# Altium project loz-old-man.PrjPcb (part 5 of 5)

## Sheet USB.SchDoc
size B; Organization: Pyrotechnics Management Inc.; DocumentNumber: 13; SheetNumber: 13; SheetTotal: 14; PageSetup: Record=PageOptions|CenterHorizontal=True|CenterVertical=True|PrintScale=0.99|XCorrection=1.00|YCorrection=1.00|PrintKind=1|BorderSize=5000000|LeftOffset=0|BottomOffset=0|Orientation=2|PaperLength=1000|PaperWidth=1000|Scale=100|PaperSource=7|PrintQuality=-4|MediaType=1|DitherType=10|PaperKind=Tabloid (11 x 17")|PrintScaleMode=1; SCHEMATIC_SHEET_TITLE: USB HOST; PAGE_TITLE: -
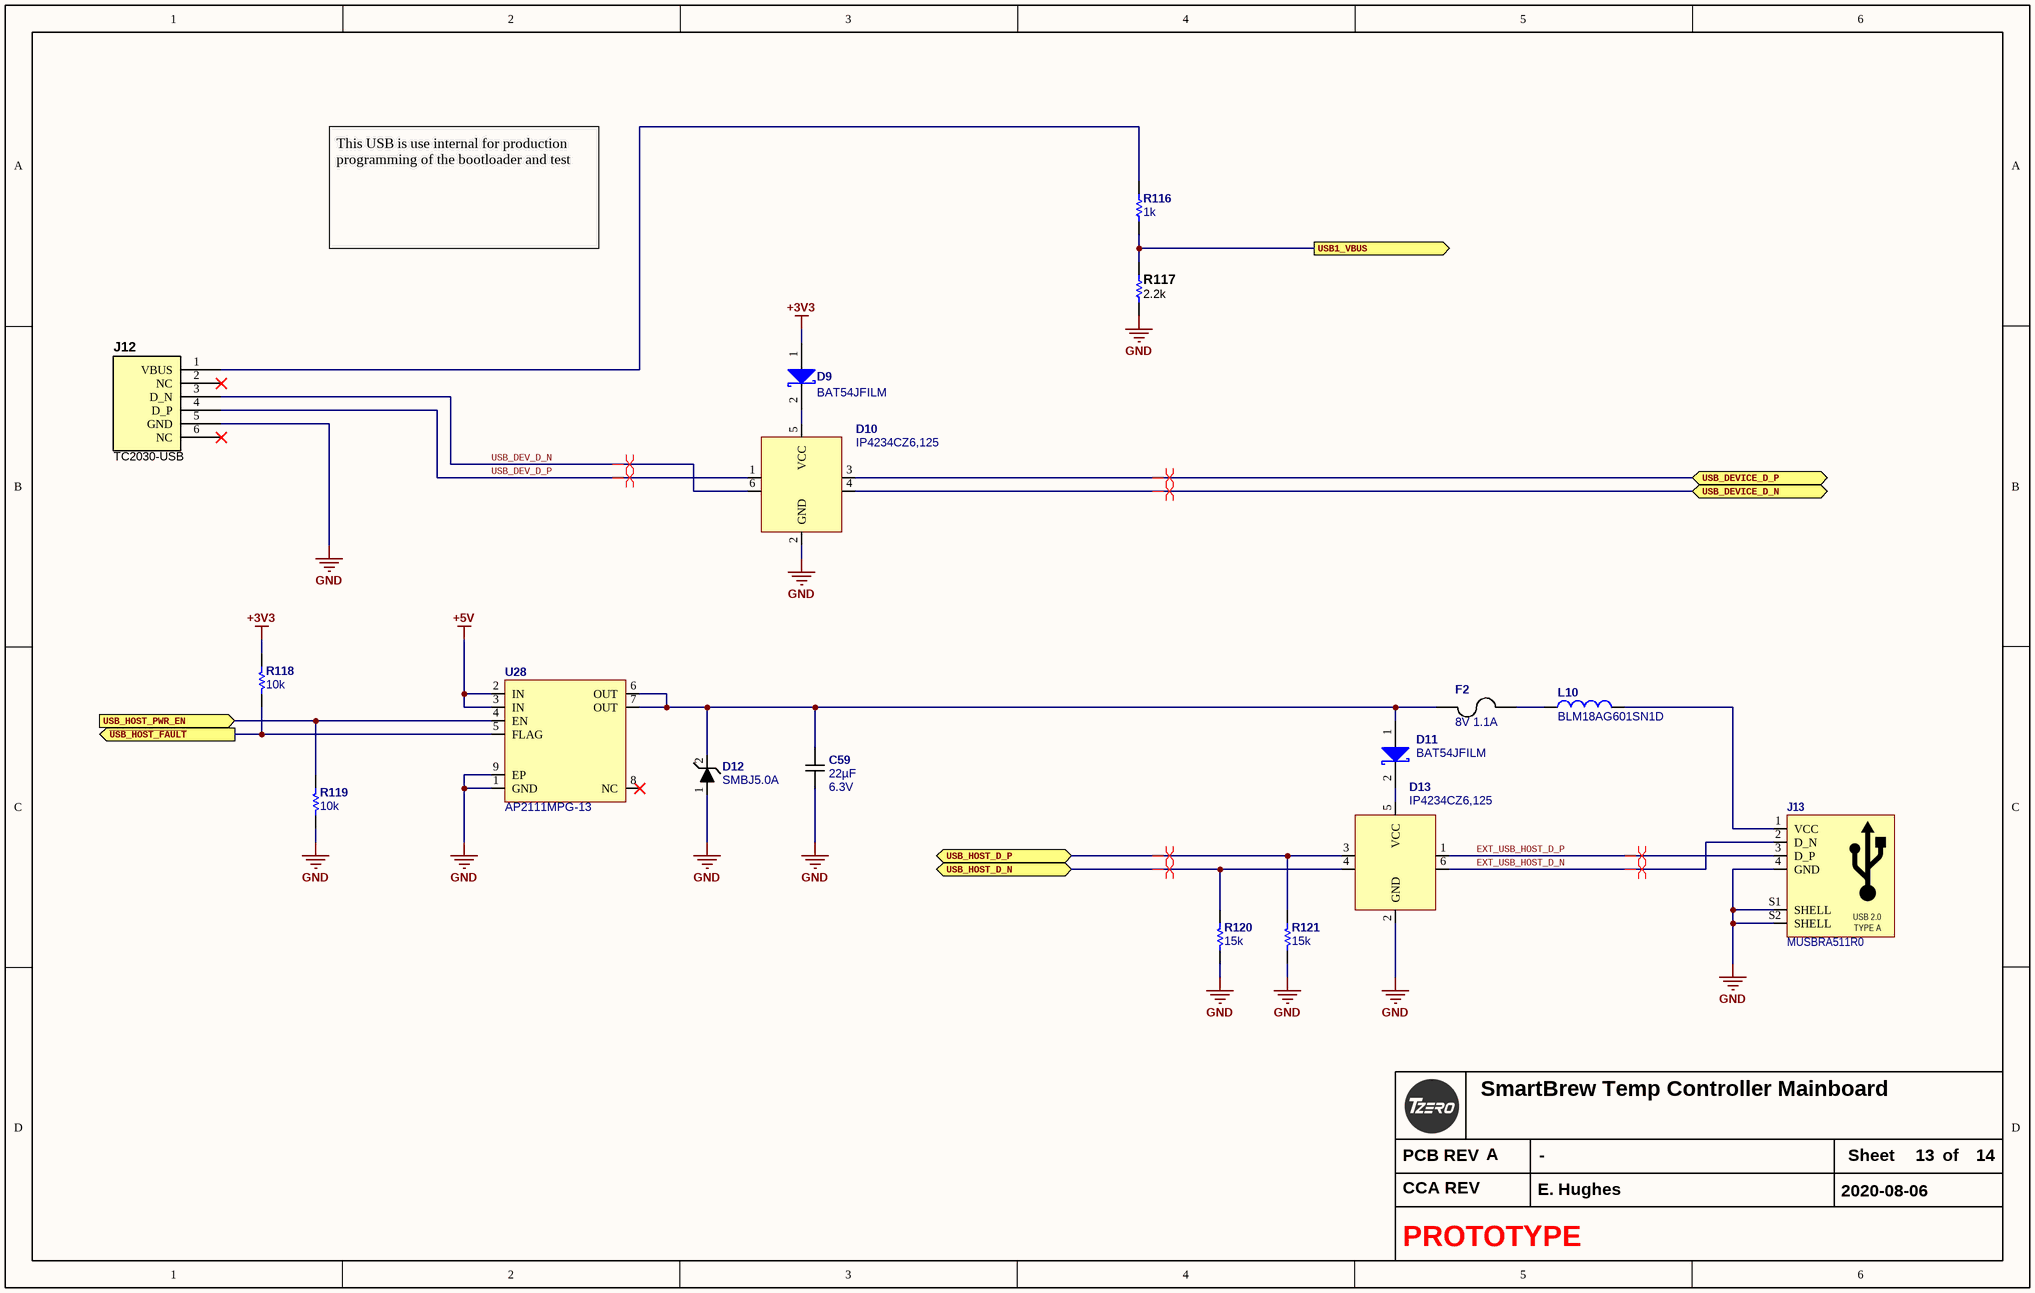
[diagram p12: USB.SchDoc]

### Parts
C59  22µF  Voltage - Rated: 6.3V  [C1206_1.60MM_HD]
D9  BAT54JFILM  [SOD-323]
D10  IP4234CZ6,125  [SOT427_MEDIUM]
D11  BAT54JFILM  [SOD-323]
D12  SMBJ5.0A  [D_SMB_P]
D13  IP4234CZ6,125  [SOT427_MEDIUM]
F2  8V 1.1A  [F_PTC_1206]
J12  TC2030‐USB  [TC2030]  (no BOM)
J13  MUSBRA511R0  [AMPHENOL_MUSBR-A511]
L10  BLM18AG601SN1D  [L_0603_0.8mm]
R116  1k  [R0603_0.55MM_MD]
R117  2.2k  [R0603_0.55MM_MD]
R118  10k  [R0603_0.55MM_MD]
R119  10k  [R0603_0.55MM_MD]
R120  15k  [R0603_0.55MM_MD]
R121  15k  [R0603_0.55MM_MD]
U28  AP2111MPG-13  [MSOP-8E]

### Ports
USB1_VBUS (out), USB_DEVICE_D_N (bidir), USB_DEVICE_D_P (bidir), USB_HOST_D_N (bidir), USB_HOST_D_P (bidir), USB_HOST_PWR_EN (in), ~{USB_HOST_FAULT} (out)

### Nets
+3V3: D9.1(A) R118.2
+5V: U28.2(IN) U28.3(IN)
GND: C59.1 D10.2(GND) D12.1(A) D13.2(GND) J12.5(GND) J13.4(GND) J13.S1(SHELL) J13.S2(SHELL) R117.1 R119.1 R120.1 R121.1 U28.1(GND) U28.9(EP)
~{USB_HOST_FAULT}: R118.1 U28.5(FLAG) ; port ~{USB_HOST_FAULT}
EXT_USB_HOST_D_N: D13.6 J13.2(D_N)
EXT_USB_HOST_D_P: D13.1 J13.3(D_P)
USB1_VBUS: R116.2 R117.2 ; port USB1_VBUS
USB_DEV_D_N: D10.6 J12.3(D_N)
USB_DEV_D_P: D10.1 J12.4(D_P)
USB_DEVICE_D_N: D10.4 ; port USB_DEVICE_D_N
USB_DEVICE_D_P: D10.3 ; port USB_DEVICE_D_P
USB_HOST_D_N: D13.4 R120.2 ; port USB_HOST_D_N
USB_HOST_D_P: D13.3 R121.2 ; port USB_HOST_D_P
USB_HOST_PWR_EN: R119.2 U28.4(EN) ; port USB_HOST_PWR_EN
NetC59_2: C59.2 D11.1(A) D12.2(K) F2.2 U28.6(OUT) U28.7(OUT)
NetD9_2: D9.2(K) D10.5(VCC)
NetD11_2: D11.2(K) D13.5(VCC)
NetF2_1: F2.1 L10.2
NetJ12_1: J12.1(VBUS) R116.1
NetJ13_1: J13.1(VCC) L10.1

Not connected (* = marked no-connect by the designer): J12 2(NC)* 6(NC)*; U28 8(NC)*

### Layout directives
differential pair; differential pair class DIFF90: EXT_USB_HOST_D_N, EXT_USB_HOST_D_P, USB_DEV_D_N, USB_DEV_D_P, USB_DEVICE_D_N, USB_DEVICE_D_P, USB_HOST_D_N, USB_HOST_D_P

### Notes on the sheet
- This USB is use internal for production programming of the bootloader and test
- PCB REV
- Sheet
- of
- CCA REV
- (in symbol MUSBRA511R0) USB 2.0 / TYPE A

### Library data of the parts
C59 = CGA5L1X7R0J226M160AC: CAP CER 22UF 6.3V X7R 1206; Manufacturer: TDK Corporation; Tolerance: ±20%; Substitution Notes: 22µF , 6.3V , ±20% , X7R , -55°C ~ 125°C , AEC-Q200 , 1206; Value: 22µF; Temperature Coefficient: X7R; Manufacturer Part Number: CGA5L1X7R0J226M160AC; ComponentLink1Description: Datasheet (Internal); ComponentLink1URL: datasheets\TDK\mlcc_automotive_general_en.pdf; ComponentLink2Description: Datasheet (External); ComponentLink2URL: https://product.tdk.com/info/en/catalog/datasheets/mlcc_automotive_general_en.pdf; Supplier 1: Digikey; Supplier Part Number 1: 445-7884-1-ND; Category: Capacitors; Features: -; Ratings: AEC-Q200; Package: 1206; Thickness (Max): 1.60MM; Operating Temperature: -55°C ~ 125°C
D9 D11 = BAT54JFILM: DIODE SCHOTTKY 40V 300MA SOD323; Manufacturer: STMicroelectronics; CategorySort: 400; Reverse Recovery Time: 5ns; Peak Non-Repetitive Surge Current: 1A; Element Configuration: Single; Forward Voltage: 900mV; Packaging 1: Tape and Reel; Max Reverse Leakage Current: 1uA; Peak Reverse Current: 100uA; Polarity: Standard; Voltage Rating (DC): 30V; Capacitance: 10pF; Category: Diodes; Value: BAT54JFILM; Supplier 1: Digi-Key; Supplier Part Number 1: 497-7163-1-ND; Manufacturer Part Number: BAT54JFILM; Stock 1: 46673; Pricing 1: 1=0.36000, 10=0.29200, 100=0.11960, 500=0.09978, 1000=0.06933 (USD); RoHS: Yes; Mount: Surface Mount; Case/Package: SC; Number of Pins: 2; Weight: 0.01lb; Contact Plating: Tin,Matte; Min Operating Temperature: -40°C; Max Operating Temperature: 150°C; Forward Current: 300mA; Max Repetitive Reverse Voltage (Vrrm): 40V; Max Surge Current: 1A; Package Quantity: 1; Recovery Time: 5ns; Average Rectified Current: 300mA; Max Forward Surge Current (Ifsm): 1A; Termination: SMD/SMT; Output Current: 300mA; Current Rating: 300mA; Max Reverse Voltage (DC): 40V; Length: 1.8mm; Height: 1.07mm; Width: 1.45mm; Radiation Hardening: No; REACH SVHC: No SVHC; Lead Free: Lead Free; ComponentLink1URL: https://datasheet.ciiva.com/1177/1689724-1177952.pdf?src-supplier=Element14; ComponentLink1Description: https://datasheet.ciiva.com/1177/1689724-1177952.pdf?src-supplier=Element14; ComponentLink2URL: https://datasheet.ciiva.com/1200/1689724-1200625.pdf?src-supplier=Farnell; ComponentLink2Description: https://datasheet.ciiva.com/1200/1689724-1200625.pdf?src-supplier=Farnell; ComponentLink3URL: https://datasheet.ciiva.com/1200/cd00001322-1200626.pdf?src-supplier=Farnell; ComponentLink3Description: https://datasheet.ciiva.com/1200/cd00001322-1200626.pdf?src-supplier=Farnell; ComponentLink4URL: https://datasheet.ciiva.com/15192/getdatasheetpartid-185078-15192983.pdf?src-supplier=Verical; ComponentLink4Description: https://datasheet.ciiva.com/15192/getdatasheetpartid-185078-15192983.pdf?src-supplier=Verical; ComponentLink5URL: https://datasheet.ciiva.com/915/cd00001322-915529.pdf?src-supplier=Digi-Key; ComponentLink5Description: https://datasheet.ciiva.com/915/cd00001322-915529.pdf?src-supplier=Digi-Key; ComponentLink6URL: https://datasheet.ciiva.com/25954/cd00001322-25954459.pdf?src-supplier=Avnet+Europe; ComponentLink6Description: https://datasheet.ciiva.com/25954/cd00001322-25954459.pdf?src-supplier=Avnet+Europe; ComponentLink7URL: https://datasheet.ciiva.com/1177/1689724-1177950.pdf?src-supplier=Element14; ComponentLink7Description: https://datasheet.ciiva.com/1177/1689724-1177950.pdf?src-supplier=Element14; ComponentLink8URL: https://datasheet.ciiva.com/915/cd00001322-915527.pdf?src-supplier=Digi-Key; ComponentLink8Description: https://datasheet.ciiva.com/915/cd00001322-915527.pdf?src-supplier=Digi-Key; ComponentLink9URL: https://datasheet.ciiva.com/915/cd00001322-915528.pdf?src-supplier=Digi-Key; ComponentLink9Description: https://datasheet.ciiva.com/915/cd00001322-915528.pdf?src-supplier=Digi-Key; ComponentLink10URL: https://datasheet.ciiva.com/1177/1689724-1177951.pdf?src-supplier=Element14; ComponentLink10Description: https://datasheet.ciiva.com/1177/1689724-1177951.pdf?src-supplier=Element14; ComponentLink11URL: https://datasheet.ciiva.com/7622/1689724-7622351.pdf?src-supplier=Element14; ComponentLink11Description: https://datasheet.ciiva.com/7622/1689724-7622351.pdf?src-supplier=Element14
D10 D13 = IP4234CZ6,125: IC USB2.0 ESD PROTECTION SOT457; Manufacturer: NXP Semiconductors; CategorySort: 400; Voltage - Reverse Standoff (Typ): 3V; Voltage - Breakdown: 6V; Power (Watts): 100W; Polarization: 2 Channel Array - Bidirectional; Value: IP4234CZ6,125; Sort Value: *; Category: Diodes; Supplier 1: Digi-Key; Supplier Part Number 1: 568-5869-1-ND; Manufacturer Part Number: IP4234CZ6,125; RoHS: RoHS Compliant; Stock 1: 5142; Pricing 1: 1=0.52, 10=0.418, 25=0.3656, 100=0.3135, 250=0.27076, 500=0.23276, 1000=0.1805 (USD); Mounting Type: Surface Mount; Package: SC-74, SOT-457; Supplier Device Package: 6-TSOP; Packaging: Cut Tape (CT); ComponentLink1URL: http://www.nxp.com/documents/data_sheet/IP4234CZ6.pdf; ComponentLink1Description: http://www.nxp.com/documents/data_sheet/IP4234CZ6.pdf; Manufacturer 1: NXP Semiconductors; Manufacturer Part Number 1: IP4234CZ6,125
D12 = SMBJ5.0A: TVS 5.0 VOLT 600 WATT UNI-DIR SM; Manufacturer: Littelfuse Inc; CategorySort: 850; Voltage - Reverse Standoff (Typ): 5V; Voltage - Breakdown: 6.4V; Power (Watts): 600W; Polarization: Unidirectional; Diode Suffix: 1A_2C; Value: SMBJ5.0A; Category: Circuit Protection; Supplier 1: Digi-Key; Supplier Part Number 1: SMBJ5.0ALFCT-ND; Manufacturer Part Number: SMBJ5.0A; Package: DO-214AA- SMB; Packaging: Cut Tape (CT); ComponentLink1URL: http://www.littelfuse.com/~/media/Files/Littelfuse/Technical%20Resources/Documents/Data%20Sheets/Littelfuse_TVS%20Diode_SMBJ.pdf; ComponentLink1Description: Internal Datasheet; ComponentLink2Description: External Datasheet; ComponentLink2URL: http://www.littelfuse.com/~/media/Files/Littelfuse/Technical%20Resources/Documents/Data%20Sheets/Littelfuse_TVS%20Diode_SMBJ.pdf; Stocked: -; SortValue: SMBJ5.0A; Pricing: 1 = 0.46  ;  10 = 0.384  ;  25 = 0.336  ;  100 = 0.2877  ;  250 = 0.24952  ;  500 = 0.21134  ;  1000 = 0.16293 (USD); Sales Status: Active; Mounting Type: Surface Mount; Supplier Device Package: SMB
F2 = 1206L110THYR: FUSE PTC RESET 8V 1.10A 1206; Manufacturer: Littelfuse Inc; CategorySort: 850; Current - Trip (It): 2.2A; Current - Max: 100A; R Min/Max: 0.040 ~ 0.180 Ohm; Time to Trip: 0.1s; Current Trip: 1.1; Value: 8V 1.1A; Sort Value: *; Category: Circuit Protection; Manufacturer Part Number: 1206L110THYR; ComponentLink1Description: Internal Datasheet; ComponentLink1URL: http://www.littelfuse.com/data/en/Data_Sheets/Littelfuse_PTC_1206L.pdf; ComponentLink2Description: External Datasheet; ComponentLink2URL: http://www.littelfuse.com/data/en/Data_Sheets/Littelfuse_PTC_1206L.pdf; Supplier 1: Digi-Key; Supplier Part Number 1: F3371CT-ND; SortValue: 8_1.1; Current - Hold (Ih) (Max): 1.1A; Voltage - Max: 8V; Package: 1206 (3216 Metric)- Concave- Long Side Terminals; Packaging: Cut Tape (CT); Footprint: 1206
J12 = TC2030‐USB: Tag Connect Pads - No latching Clips - USB; Value: TC2030‐USB
J13 = MUSBRA511R0: CONN RCPT USB2.0 TYPEA 4POS PCB; Manufacturer: Amphenol Industrial; CategorySort: 800; Packaging 1: Bulk; Connector Type: USB; Number of Contacts: 4; Gender: Receptacle; Ratings: IP67; Category: Connectors; Value: MUSBRA511R0; Supplier 1: Digi-Key; Supplier Part Number 1: MUSBRA511R0-ND; Manufacturer Part Number: MUSBRA511R0; Stock 1: 619; Pricing 1: 1=9.44000, 10=9.02900, 25=8.20800, 50=7.79760, 100=7.59240, 250=6.77160, 500=6.36120, 1000=5.92800 (USD); RoHS: Yes; Mount: Through Hole,Panel; Orientation: Straight; Features: Shielded; Flammability Rating: UL94 V-0; ComponentLink1URL: https://cdn.amphenol-icc.com/media/wysiwyg/files/documentation/datasheet/inputoutput/io_harsh_musb-type-a-b-ab.pdf?src-supplier=Digi-Key; ComponentLink1Description: https://cdn.amphenol-icc.com/media/wysiwyg/files/documentation/datasheet/inputoutput/io_harsh_musb-type-a-b-ab.pdf?src-supplier=Digi-Key
L10 = BLM18AG601SN1D: FERRITE CHIP 600 OHM 500MA 0603; Manufacturer: Murata Electronics North America; CategorySort: 300; Impedance @ Frequency: 600 Ohm @ 100MHz; DC Resistance (DCR): 380 mOhm Max; Filter Type: Differential Mode - Single; Value: BLM18AG601SN1D; Sort Value: *; Category: Inductors; Supplier 1: Digi-Key; Supplier Part Number 1: 490-1014-1-ND; Manufacturer Part Number: BLM18AG601SN1D; RoHS: RoHS Compliant; Stock 1: 139441; Pricing 1: 1=0.1, 10=0.079, 50=0.0648, 100=0.0476, 250=0.0346, 500=0.0317, 1000=0.02738 (USD); Packaging: Cut Tape (CT); Current Rating: 500mA; Package: 0603 (1608 Metric); Mounting Type: Surface Mount; Height (Max): 0.037" (0.95mm); Size / Dimension: 0.063" L x 0.031" W (1.60mm x 0.80mm); ComponentLink1URL: http://search.murata.co.jp/Ceramy/image/img/PDF/ENG/L0110S0100BLM18A.pdf; ComponentLink1Description: http://search.murata.co.jp/Ceramy/image/img/PDF/ENG/L0110S0100BLM18A.pdf
R116 = ERJ-3EKF1001V: RES 1K OHM 1/10W 1% 0603 SMD; Manufacturer: Panasonic Electronic Components; Package Power: 0603  (0.1W); Power (Watts): 0.1W- 1/10W; Temperature Coefficient: ±100ppm/°C; Limiting Element Voltage: 75; Maximum Overload Voltage: 150; Maximum Working Voltage: 10.0V; Substitution Notes: 1k , ±1% , 0603 , AEC-Q200; Value: 1k; Manufacturer Part Number: ERJ-3EKF1001V; ComponentLink1Description: Internal Datasheet; ComponentLink1URL: datasheets\Panasonic Electronic Components\AOA0000CE2.pdf; ComponentLink2Description: External Datasheet; ComponentLink2URL: http://industrial.panasonic.com/www-data/pdf/AOA0000/AOA0000CE2.pdf; Supplier 1: Digi-Key; Supplier Part Number 1: P1.00KHCT-ND; Category: Resistors; Resistance (Ohms): 1k; Composition: Thick Film; Features: -; Tolerance: ±1%; Package: 0603 (1608 Metric); Supplier Package: 0603; Size / Dimension: 0.063" L x 0.031" W (1.60mm x 0.80mm); Height: 0.55MM; Number of Terminations: 2; Packaging: Cut Tape (CT); Sort Value: 1000; Sort Value Package: 603_1000; Ratings: AEC-Q200
R117 = ERJ-3EKF2201V: RES 2.2K OHM 1/10W 1% 0603 SMD; Manufacturer: Panasonic Electronic Components; Package Power: 0603  (0.1W); Power (Watts): 0.1W- 1/10W; Temperature Coefficient: ±100ppm/°C; Limiting Element Voltage: 75; Maximum Overload Voltage: 150; Maximum Working Voltage: 14.8V; Substitution Notes: 2.2k , ±1% , 0603 , AEC-Q200; Value: 2.2k; Manufacturer Part Number: ERJ-3EKF2201V; ComponentLink1Description: Internal Datasheet; ComponentLink1URL: datasheets\Panasonic Electronic Components\AOA0000CE2.pdf; ComponentLink2Description: External Datasheet; ComponentLink2URL: http://industrial.panasonic.com/www-data/pdf/AOA0000/AOA0000CE2.pdf; Supplier 1: Digi-Key; Supplier Part Number 1: P2.20KHCT-ND; Category: Resistors; Resistance (Ohms): 2.2k; Composition: Thick Film; Features: -; Tolerance: ±1%; Package: 0603 (1608 Metric); Supplier Package: 0603; Size / Dimension: 0.063" L x 0.031" W (1.60mm x 0.80mm); Height: 0.55MM; Number of Terminations: 2; Packaging: Cut Tape (CT); Sort Value: 2200; Sort Value Package: 603_2200; Ratings: AEC-Q200
R118 R119 = ERJ-3EKF1002V: RES 10K OHM 1/10W 1% 0603 SMD; Manufacturer: Panasonic Electronic Components; Power (Watts): 0.1W- 1/10W; Temperature Coefficient: ±100ppm/°C; Package Power: 0603  (0.1W); Limiting Element Voltage: 75; Maximum Overload Voltage: 150; Maximum Working Voltage: 31.6V; Substitution Notes: 10k , ±1% , 0603 , AEC-Q200; Value: 10k; Supplier 1: Digi-Key; Supplier Part Number 1: P10.0KHCT-ND; Manufacturer Part Number: ERJ-3EKF1002V; Category: Resistors; Sort Value: 10000; Composition: Thick Film; Features: -; Tolerance: ±1%; Package: 0603 (1608 Metric); Size / Dimension: 0.063" L x 0.031" W (1.60mm x 0.80mm); Height: 0.55MM; Packaging: Cut Tape (CT); ComponentLink1URL: datasheets\Panasonic Electronic Components\AOA0000CE2.pdf; ComponentLink1Description: Internal Datasheet; ComponentLink2Description: External Datasheet; ComponentLink2URL: http://industrial.panasonic.com/www-data/pdf/AOA0000/AOA0000CE2.pdf; Resistance (Ohms): 10k; Supplier Package: 0603; Number of Terminations: 2; Sort Value Package: 603_10000; Ratings: AEC-Q200
R120 R121 = ERJ-3EKF1502V: RES 15K OHM 1/10W 1% 0603 SMD; Manufacturer: Panasonic Electronic Components; Power (Watts): 0.1W- 1/10W; Temperature Coefficient: ±100ppm/°C; Package Power: 0603  (0.1W); Limiting Element Voltage: 75; Maximum Overload Voltage: 150; Maximum Working Voltage: 38.7V; Substitution Notes: 15k , ±1% , 0603 , AEC-Q200; Value: 15k; Supplier 1: Digi-Key; Supplier Part Number 1: P15.0KHCT-ND; Manufacturer Part Number: ERJ-3EKF1502V; Category: Resistors; Sort Value: 15000; Composition: Thick Film; Features: -; Tolerance: ±1%; Package: 0603 (1608 Metric); Size / Dimension: 0.063" L x 0.031" W (1.60mm x 0.80mm); Height: 0.55MM; Packaging: Cut Tape (CT); ComponentLink1URL: datasheets\Panasonic Electronic Components\AOA0000CE2.pdf; ComponentLink1Description: Internal Datasheet; ComponentLink2Description: External Datasheet; ComponentLink2URL: http://industrial.panasonic.com/www-data/pdf/AOA0000/AOA0000CE2.pdf; Resistance (Ohms): 15k; Supplier Package: 0603; Number of Terminations: 2; Sort Value Package: 603_15000; Ratings: AEC-Q200
U28 = AP2111MPG-13: IC USB SWITCH 2.45A CURR 8MSOP; Manufacturer: Diodes; CategorySort: 600; Packaging 1: Tape and Reel; Number of Outputs: 1; Max Output Current: 2A; Min Input Voltage: 2.5V; Max Input Voltage: 6V; Quiescent Current: 55uA; Accuracy: 1.5%; Output Type: Fixed; Interface: On/Off; Fault Protection: Over Temperature,Reverse Current; Output Configuration: High Side; Operating Supply Current: 45uA; Category: Integrated Circuits; Value: AP2111MPG-13; Supplier 1: Digi-Key; Supplier Part Number 1: AP2111MPG-13DICT-ND; Manufacturer Part Number: AP2111MPG-13; Stock 1: 1715; Pricing 1: 1=0.46000, 10=0.39000, 100=0.29120, 500=0.22880, 1000=0.17680 (USD); RoHS: Yes; Mount: Surface Mount; Case/Package: MSOP; Number of Pins: 8; Contact Plating: Tin,Matte; Min Operating Temperature: -35°C; Max Operating Temperature: 85°C; Package Quantity: 2500; Radiation Hardening: No; REACH SVHC: No SVHC; Lead Free: Lead Free; ComponentLink1URL: https://datasheet.ciiva.com/3234/ap2101-2111-3234512.pdf?src-supplier=Avnet; ComponentLink1Description: https://datasheet.ciiva.com/3234/ap2101-2111-3234512.pdf?src-supplier=Avnet; ComponentLink2URL: https://datasheet.ciiva.com/15108/getdatasheetpartid-661766-15108856.pdf?src-supplier=Verical; ComponentLink2Description: https://datasheet.ciiva.com/15108/getdatasheetpartid-661766-15108856.pdf?src-supplier=Verical; ComponentLink3URL: https://datasheet.ciiva.com/1962/ap2101-2111-1962212.pdf?src-supplier=Digi-Key; ComponentLink3Description: https://datasheet.ciiva.com/1962/ap2101-2111-1962212.pdf?src-supplier=Digi-Key; ComponentLink4URL: https://datasheet.ciiva.com/12183/ap2101-2111-12183962.pdf?src-supplier=Mouser; ComponentLink4Description: https://datasheet.ciiva.com/12183/ap2101-2111-12183962.pdf?src-supplier=Mouser

## Nets that join several sheets
+3V3: SolenoidDrive (8 pins), Cell (J6.2 R31.2 U15.20 U16.5), LCD_IO (J11.1 J11.2 J11.3 J11.6), SensorInterface (5 pins), Encoder (R22.2 R23.2 R24.2), POWER (C12.1 J3.2 U2.3), RAM (17 pins), CAN (U17.3), Microprocessor1 (5 pins), Microprocessor Power (42 pins), Flash Memory (22 pins), USB (D9.1 R118.2)
+5V: Cell (C33.2 J6.1 J7.1), LCD_IO (C57.2 L9.1 U27.4 U27.5), POWER (J4.2), USB (U28.2 U28.3)
+12V_FILT: TOP_LEVEL (J2.1), SolenoidDrive (C19.1 D3.2 U4.3), SensorInterface (U13.8), POWER (5 pins), Microprocessor Power (R41.2)
GND: TOP_LEVEL (J2.2), SolenoidDrive (14 pins), Cell (9 pins), LCD_IO (23 pins), SensorInterface (16 pins), Encoder (7 pins), POWER (25 pins), RAM (17 pins), CAN (D6.3 R40.1 U17.2), Microprocessor1 (5 pins), Microprocessor Power (53 pins), Flash Memory (21 pins), USB (14 pins)
12V_IN: TOP_LEVEL (J1.1), POWER (F1.1)
~{CELL_CTS}: Cell (R34.1), Microprocessor1 (U19.E4)
~{CELL_DTR}: Cell (U15.4), Microprocessor1 (U19.F6)
~{CELL_RTS}: Cell (U15.6), Microprocessor1 (U19.F5)
~{LCD_RESET_N}: LCD_IO (J11.13), Microprocessor1 (U19.K4)
~{SENSOR_FAULT}: SensorInterface (R15.1 U13.3), Microprocessor1 (U19.E2)
~{SSP1_CS_FRAM}: Microprocessor1 (U19.D11), Flash Memory (R94.2)
~{USB_HOST_FAULT}: Microprocessor1 (U19.L11), USB (R118.1 U28.5)
CAN0_H: TOP_LEVEL (J2.4), CAN (D6.1 R39.2 U17.7)
CAN0_L: TOP_LEVEL (J2.5), CAN (D6.2 R39.1 U17.6)
CAN0_RD: CAN (U17.4), Microprocessor1 (U19.M14)
CAN0_TD: CAN (U17.1), Microprocessor1 (U19.K12)
CELL_RESET: Cell (U15.8), Microprocessor1 (U19.K2)
ENC_BUTTON: Encoder (R21.1), Microprocessor1 (U19.B1)
ENC_PHASE_A: Encoder (R27.1), Microprocessor1 (U19.A1)
ENC_PHASE_B: Encoder (R29.1), Microprocessor1 (U19.C2)
GND_IN: TOP_LEVEL (J1.2), POWER (5 pins)
LCD_CS: LCD_IO (J11.12), Microprocessor1 (U19.H5)
LCD_DC: LCD_IO (J11.10), Microprocessor1 (U19.E5)
POR: POWER (D2.2), Microprocessor Power (Q3.1 R50.2)
SCL: TOP_LEVEL (TP2.1), Microprocessor Power (R42.2 U19.L15)
SDA: TOP_LEVEL (TP1.1), Microprocessor Power (R43.2 U19.L16)
SENSOR_CUR_FB: SensorInterface (U14.1 U14.4), Microprocessor Power (U19.A4)
SENSOR_ENABLE: SensorInterface (R16.1), Microprocessor1 (U19.J12)
SENSOR_RX_EN: SensorInterface (R13.2 U12.2), Microprocessor1 (U19.A7)
SENSOR_RX_IN: SensorInterface (U12.1), Microprocessor1 (U19.N1)
SENSOR_TX_EN: SensorInterface (R14.1 U12.3), Microprocessor1 (U19.K11)
SENSOR_TX_OUT: SensorInterface (U12.4), Microprocessor1 (U19.M1)
SOL_N: TOP_LEVEL (J2.3), SolenoidDrive (D3.1 Q1.2 Q1.4)
SOLENOID_CUR_FB: SolenoidDrive (C26.2 U8.1 U8.4), Microprocessor Power (U19.C3)
SOLENOID_CUR_SP: SolenoidDrive (U6.3), Microprocessor Power (U19.E3)
SOLENOID_ON: SolenoidDrive (R6.1), Microprocessor1 (U19.T3)
SSP1_MISO: LCD_IO (J11.8), Flash Memory (R91.2 U19.E7)
SSP1_MOSI: LCD_IO (J11.9), Flash Memory (R92.2 U19.B7)
SSP1_SCK: LCD_IO (J11.11), Flash Memory (R93.2 U19.D10)
U0_RXD_IN: TOP_LEVEL (J1.4), Microprocessor1 (D7.4)
U0_TXD_OUT: TOP_LEVEL (J1.3), Microprocessor1 (D7.3)
UART2_RX: Cell (R32.2), Microprocessor1 (U19.K15)
UART2_TX: Cell (U15.2), Microprocessor1 (U19.J14)
USB1_VBUS: Microprocessor1 (U19.K14), USB (R116.2 R117.2)
USB_DEVICE_D_N: Microprocessor Power (U19.G12), USB (D10.4)
USB_DEVICE_D_P: Microprocessor Power (U19.F12), USB (D10.3)
USB_HOST_D_N: Microprocessor Power (U19.G2), USB (D13.4 R120.2)
USB_HOST_D_P: Microprocessor Power (U19.F2), USB (D13.3 R121.2)
USB_HOST_PWR_EN: Microprocessor Power (R47.1 U19.P15), USB (R119.2 U28.4)

## Assembly variants
A: not fitted R62